# Altium schematic sheet MARS_MIO.SchDoc: My title
size A3; Organization: University of California; Address1: 475 Portola Plaza; Address2: Los Angeles, CA 90095; DocumentNumber: 24; Revision: R01; SheetNumber: 24; SheetTotal: 35
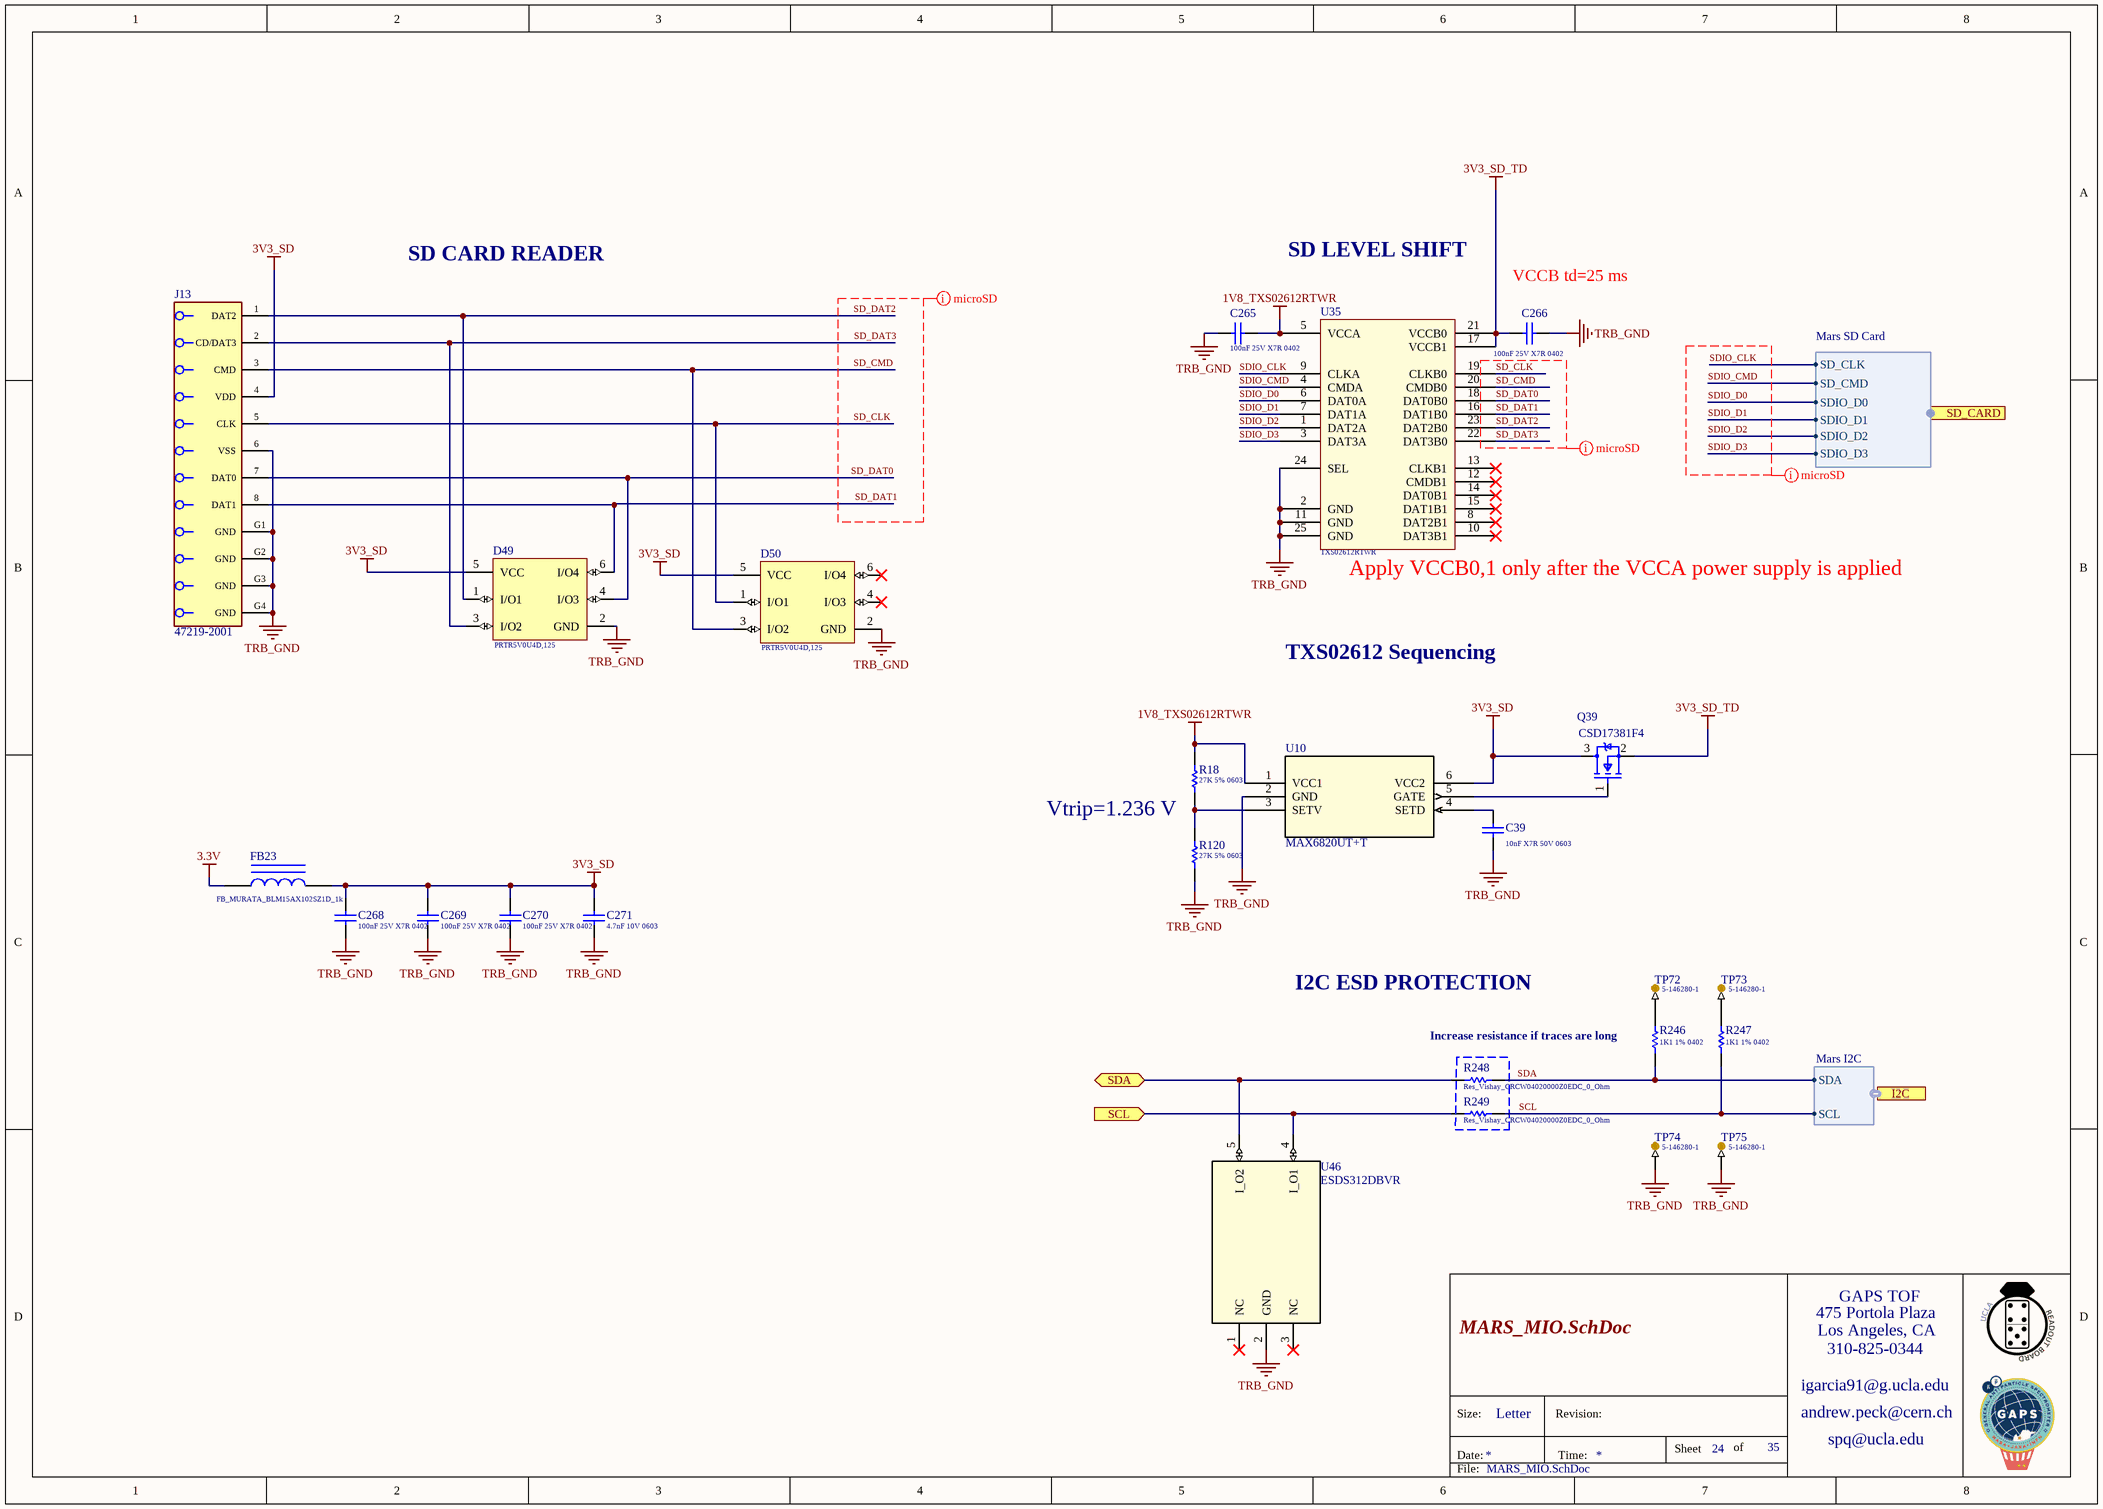
[diagram p0: MARS_MIO.SchDoc]

## Parts
C39  Capacitance: 10nF X7R 50V 0603  [Kemet_C0603_0]  (hidden comment: Cap_Kemet_C0603C103J5RACTU_eec)
C265  Capacitance: 100nF 25V X7R 0402  [Cap_Taiyo_Yuden_TMK105B7104KV-FR_100nF]  (hidden comment: Cap_Taiyo_Yuden_TMK105B7104KV-FR_100nF)
C266  Capacitance: 100nF 25V X7R 0402  [Cap_Taiyo_Yuden_TMK105B7104KV-FR_100nF]  (hidden comment: Cap_Taiyo_Yuden_TMK105B7104KV-FR_100nF)
C268  Capacitance: 100nF 25V X7R 0402  [Cap_Taiyo_Yuden_TMK105B7104KV-FR_100nF]  (hidden comment: Cap_Taiyo_Yuden_TMK105B7104KV-FR_100nF)
C269  Capacitance: 100nF 25V X7R 0402  [Cap_Taiyo_Yuden_TMK105B7104KV-FR_100nF]  (hidden comment: Cap_Taiyo_Yuden_TMK105B7104KV-FR_100nF)
C270  Capacitance: 100nF 25V X7R 0402  [Cap_Taiyo_Yuden_TMK105B7104KV-FR_100nF]  (hidden comment: Cap_Taiyo_Yuden_TMK105B7104KV-FR_100nF)
C271  4.7nF 10V 0603  [CAPC0603(1608)100_L]
D49  PRTR5V0U4D,125  [PRTR5V0U4D,125]
D50  PRTR5V0U4D,125  [PRTR5V0U4D,125]
FB23  FB_MURATA_BLM15AX102SZ1D_1k  [FB_MURATA_BLM15AX102SZ1D_1k]
J13  Part Number: 47219-2001  [Molex_47219-2001_0]  (hidden comment: Conn_Molex_47219-2001_eec)
Q39  CSD17381F4  [Texas_Instruments_3-PICOSTAR_0]
R18  27K 5% 0603  [RESC0603(1608)_L]
R120  27K 5% 0603  [RESC0603(1608)_L]
R246  1K1 1% 0402  [RESC0402(1005)_L]
R247  1K1 1% 0402  [RESC0402(1005)_L]
R248  Res_Vishay_CRCW04020000Z0EDC_0_Ohm  [Res_Vishay_CRCW04020000Z0EDC_0_Ohm]
R249  Res_Vishay_CRCW04020000Z0EDC_0_Ohm  [Res_Vishay_CRCW04020000Z0EDC_0_Ohm]
TP72  Series: 5-146280-1  [TP_TE_Connectivity_5-146280-1_1POS]  (hidden comment: TP_TE_Connectivity_5-146280-1_1POS)
TP73  Series: 5-146280-1  [TP_TE_Connectivity_5-146280-1_1POS]  (hidden comment: TP_TE_Connectivity_5-146280-1_1POS)
TP74  Series: 5-146280-1  [TP_TE_Connectivity_5-146280-1_1POS]  (hidden comment: TP_TE_Connectivity_5-146280-1_1POS)
TP75  Series: 5-146280-1  [TP_TE_Connectivity_5-146280-1_1POS]  (hidden comment: TP_TE_Connectivity_5-146280-1_1POS)
U10  MAX6820UT+T  [21-0058I_MXM]
U35  Series: TXS02612RTWR  [IC_TXS02612RTWR_SD_Level_Shifter]  (hidden comment: IC_TXS02612RTWR_SD_Level_Shifter)
U46  ESDS312DBVR  [DBV0005A_L]

## Ports
I2C (harness Mars I2C), SCL (in), SD_CARD (harness Mars SD Card), SDA (bidir)

## Harnesses
Mars SD Card: SDIO_D2, SDIO_D1, SDIO_D0, SD_CMD, SD_CLK, SDIO_D3
Mars I2C: SCL, SDA

## Nets
1V8_TXS02612RTWR: C265.1 R18.2 U10.1(VCC1) U35.5(VCCA)
3.3V: FB23.1
3V3_SD: C268.2 C269.2 C270.2 C271.1 D49.5(VCC) D50.5(VCC) FB23.2 J13.4(VDD) Q39.3(DRAIN) U10.6(VCC2)
3V3_SD_TD: C266.2 Q39.2(SOURCE) U35.17(VCCB1) U35.21(VCCB0)
TRB_GND: C39.2 C265.2 C266.1 C268.1 C269.1 C270.1 C271.2 D49.2(GND) D50.2(GND) J13.6(VSS) J13.G1(GND) J13.G2(GND) J13.G3(GND) J13.G4(GND) R120.1 TP74.1 TP75.1 U10.2(GND) U35.2(GND) U35.11(GND) U35.24(SEL) U35.25(GND) U46.2(GND)
SCL: R249.2 U46.4(I_O1) ; port SCL
SCL: R247.1 R249.1 ; port I2C.SCL  [a separate net that carries the same name]
SD_CLK: D50.1(I/O1) J13.5(CLK) U35.19(CLKB0)
SD_CMD: D50.3(I/O2) J13.3(CMD) U35.20(CMDB0)
SD_DAT0: D49.4(I/O3) J13.7(DAT0) U35.18(DAT0B0)
SD_DAT1: D49.6(I/O4) J13.8(DAT1) U35.16(DAT1B0)
SD_DAT2: D49.1(I/O1) J13.1(DAT2) U35.23(DAT2B0)
SD_DAT3: D49.3(I/O2) J13.2(CD/DAT3) U35.22(DAT3B0)
SDA: R248.2 U46.5(I_O2) ; port SDA
SDA: R246.1 R248.1 ; port I2C.SDA  [a separate net that carries the same name]
SDIO_CLK: U35.9(CLKA) ; port SD_CARD.SD_CLK
SDIO_CMD: U35.4(CMDA) ; port SD_CARD.SD_CMD
SDIO_D0: U35.6(DAT0A) ; port SD_CARD.SDIO_D0
SDIO_D1: U35.7(DAT1A) ; port SD_CARD.SDIO_D1
SDIO_D2: U35.1(DAT2A) ; port SD_CARD.SDIO_D2
SDIO_D3: U35.3(DAT3A) ; port SD_CARD.SDIO_D3
NetC39_1: C39.1 U10.4(SETD)
NetQ39_1: Q39.1(GATE) U10.5(GATE)
NetR18_1: R18.1 R120.2 U10.3(SETV)
NetR246_2: R246.2 TP72.1
NetR247_2: R247.2 TP73.1

Not connected (* = marked no-connect by the designer): D50 4(I/O3)* 6(I/O4)*; U35 8(DAT2B1)* 10(DAT3B1)* 12(CMDB1)* 13(CLKB1)* 14(DAT0B1)* 15(DAT1B1)*; U46 1(NC)* 3(NC)*

## Layout directives
net class S50; rule Matched Net Lengths [Tolerance = 100mil]: SD_CLK, SD_CMD, SD_DAT0, SD_DAT1, SD_DAT2, SD_DAT3, SDIO_CLK, SDIO_CMD, SDIO_D0, SDIO_D1, SDIO_D2, SDIO_D3

## Notes on the sheet
- SD CARD READER
- SD LEVEL SHIFT
- VCCB td=25 ms
- (near U35) Apply VCCB0,1 only after the VCCA power supply is applied
- TXS02612 Sequencing
- (near R18) Vtrip=1.236 V
- I2C ESD PROTECTION
- (near R246) Increase resistance if traces are long
- 475 Portola Plaza
- GAPS TOF
- igarcia91@g.ucla.edu
- Los Angeles, CA
- 310-825-0344
- Size:
- Date:
- Letter
- Revision:
- Time:
- Sheet
- of
- andrew.peck@cern.ch
- spq@ucla.edu
- File:

## Library data of the parts
C39 = Cap_Kemet_C0603C103J5RACTU_eec: CAP CER 10nF 50V X7R 0603; Manufacturer: Kemet; Mfg Package Ident: C0603; Part Number: C0603C103J5RACTU; helpURL: https://upverter.com/upn/revision/8a8d0c297e33ac74/; ComponentLink2Description: Datasheet; Temperature: -55°C to +125°C; Package: C0603; Supplier 2: Mouser; Price: 0.0184203126773; Supplier 1: Digi-Key; ComponentLink1URL: https://upverter.com/upn/revision/8a8d0c297e33ac74/; Supplier Part Number 2: 80-C0603C103J5R; Supplier Part Number 1: 399-1092-1-ND; Value: 10nF; ComponentLink1Description: Upverter; ComponentLink2URL: https://content.kemet.com/datasheets/KEM_C1002_X7R_SMD.pdf; RoHS: TRUE; Mouser Part Number: 80-C0603C103J5R; Temperature Range High: +125°C; Digikey Description: CAP CER 10000PF 50V X7R 0603; Digikey Part Number: 399-1092-1-ND; Lead Free: yes; Temperature Range Low: -55°C; Voltage: 50V
C265 C266 C268-C270 = Cap_Taiyo_Yuden_TMK105B7104KV-FR_100nF: CAP CER 100nF 25V X7R 0402; Supplier 1: Mouser; Supplier Part Number 1: 963-TMK105B7104KV-FR
C271 = CMP-1035-02189-1: CAP 4.7nF 10V ±10% 0603 (1608 Metric) Thickness 1mm SMD; Case-Metric: 1608; Tolerance: Â±10%; Case-EIA: 0603; Max Thickness: 1 mm; Technology: SMT; Rated Voltage: 10 V; Value: 4.7nF
D49 D50 = PRTR5V0U4D,125: ESD Suppressors / TVS Diodes 5.5V QUAD R-R ESD ULTRA LOW CAP; Supplier 1: Mouser; Supplier Part Number 1: 771-PRTR5V0U4D-T/R
FB23 = FB_MURATA_BLM15AX102SZ1D_1k: FB SMD 1000 OHM 25% 3/4W 0402; Supplier Part Number 1: 81-BLM15AX102SZ1D; Supplier 1: Mouser
J13 = Conn_Molex_47219-2001_eec: CONN MICRO SD CARD HINGED TYPE; Manufacturer: Molex; Is Female: yes; helpURL: https://upverter.com/upn/revision/cf639670a30b6b80/; ComponentLink2Description: Datasheet; Temperature: -20°C to +85°C; Package: SMT_SDCARD_14MM5_13MM6; Supplier 2: Mouser; Supplier 1: Digi-Key; ComponentLink1URL: https://upverter.com/upn/revision/cf639670a30b6b80/; Supplier Part Number 2: 538-47219-2001; Supplier Part Number 1: WM6698CT-ND; ComponentLink1Description: Upverter; ComponentLink2URL: http://www.molex.com/pdm_docs/sd/472192001_sd.pdf; RoHS: TRUE; Mouser Part Number: 538-47219-2001; Temperature Range High: +85°C; Digikey Description: CONN MICRO SD CARD HINGED TYPE; Digikey Part Number: WM6698CT-ND; Lead Free: yes; Temperature Range Low: -20°C
Q39 = Trans_Texas_Instruments_CSD17381F4_eec: TRANS MOSFET N-CH 30V 3.1A 0402; Manufacturer: Texas Instruments; Mfg Package Ident: 3-PICOSTAR; Part Number: CSD17381F4; helpURL: https://upverter.com/upn/revision/4d3d13666fc1af7c/; ComponentLink2Description: Datasheet; Temperature: -55°C to +150°C; Package: 3-PICOSTAR; Supplier 2: Mouser; Price: 0.201706379017; Supplier 1: Digi-Key; ComponentLink1URL: https://upverter.com/upn/revision/4d3d13666fc1af7c/; Supplier Part Number 2: 595-CSD17381F4; Supplier Part Number 1: 296-38913-1-ND; ComponentLink1Description: Upverter; ComponentLink2URL: http://www.ti.com/lit/ds/symlink/csd17381f4.pdf; RoHS: TRUE; Mouser Part Number: 595-CSD17381F4; Temperature Range High: +150°C; Digikey Description: TRANS MOSFET N-CH 30V 3.1A 0402; Digikey Part Number: 296-38913-1-ND; Lead Free: yes; Temperature Range Low: -55°C
R18 R120 = CMP-1012-00108-1: 27K 0.1W 5% 0603 (1608 Metric)  SMD; Value: 27000.00 Ohm; Case-Metric: 1608; Case-EIA: 0603; Power: 0.1 W; Tolerance: 5 %; Technology: SMT
R246 R247 = CMP-1011-00514-1: 1K1 0.063W 1% 0402 (1005 Metric)  SMD; Case-Metric: 1005; Case-EIA: 0402; Value: 1100.00 Ohm; Power: 0.063 W; Tolerance: 1 %; Technology: SMT
R248 R249 = Res_Vishay_CRCW04020000Z0EDC_0_Ohm: 0R 0.062W 1% 0402 (1005 Metric)  SMD; Resistance: 0R 1% 0402; Supplier 1: Mouser; Supplier Part Number 1: 71-CRCW04020000Z0EDC
TP72-TP75 = TP_TE_Connectivity_5-146280-1_1POS: Headers & Wire Housings Unshrouded 1 POS T/H; Supplier Part Number 1: 571-51462801; Supplier 1: Mouser
U10 = MAX6820UT+T: No Description Available; Vendor: Maxim Integrated Products; Built_By: EMA_UL_Team; SourceLibrary: Maxim_2014-06-20; Manufacturer_Part_Number: MAX6820UT+T; Revision: 1; Copyright: Copyright (C) 2018 Accelerated Designs. All rights reserved; RefDes: RefDes; Type: DEV
U35 = IC_TXS02612RTWR_SD_Level_Shifter: Interface - I/O Expanders SDIO Port Expander; Supplier Part Number 1: 595-TXS02612RTWR; Supplier 1: Mouser
U46 = ESDS312DBVR: 3.6V Data-Line Surge and 30kV ESD Protection Diode; Manufacturer: Texas Instruments; PartNumber: ESDS312DBVR; RefDes: RefDes; Type: DEV; Value: Value